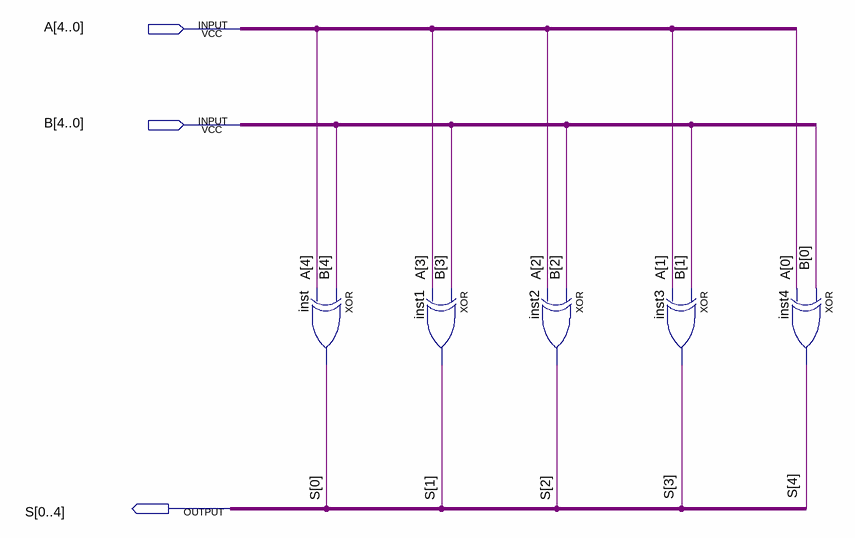
[diagram p0: schematic sheet]
// Quartus schematic OpXor.bdf as structural Verilog: 5 symbols, 3 pins
module OpXor (
  input  [4:0] A,
  input  [4:0] B,
  output [0:4] S
);

  xor inst (S[0], B[4], A[4]);
  xor inst1 (S[1], B[3], A[3]);
  xor inst2 (S[2], B[2], A[2]);
  xor inst3 (S[3], B[1], A[1]);
  xor inst4 (S[4], B[0], A[0]);
endmodule
